# Altium schematic sheet COM-Isolators.SchDoc: CDH-ACS Isolators
size B; Organization: Colorado Space Grant; DocumentNumber: 12; SheetNumber: 7; SheetTotal: 7
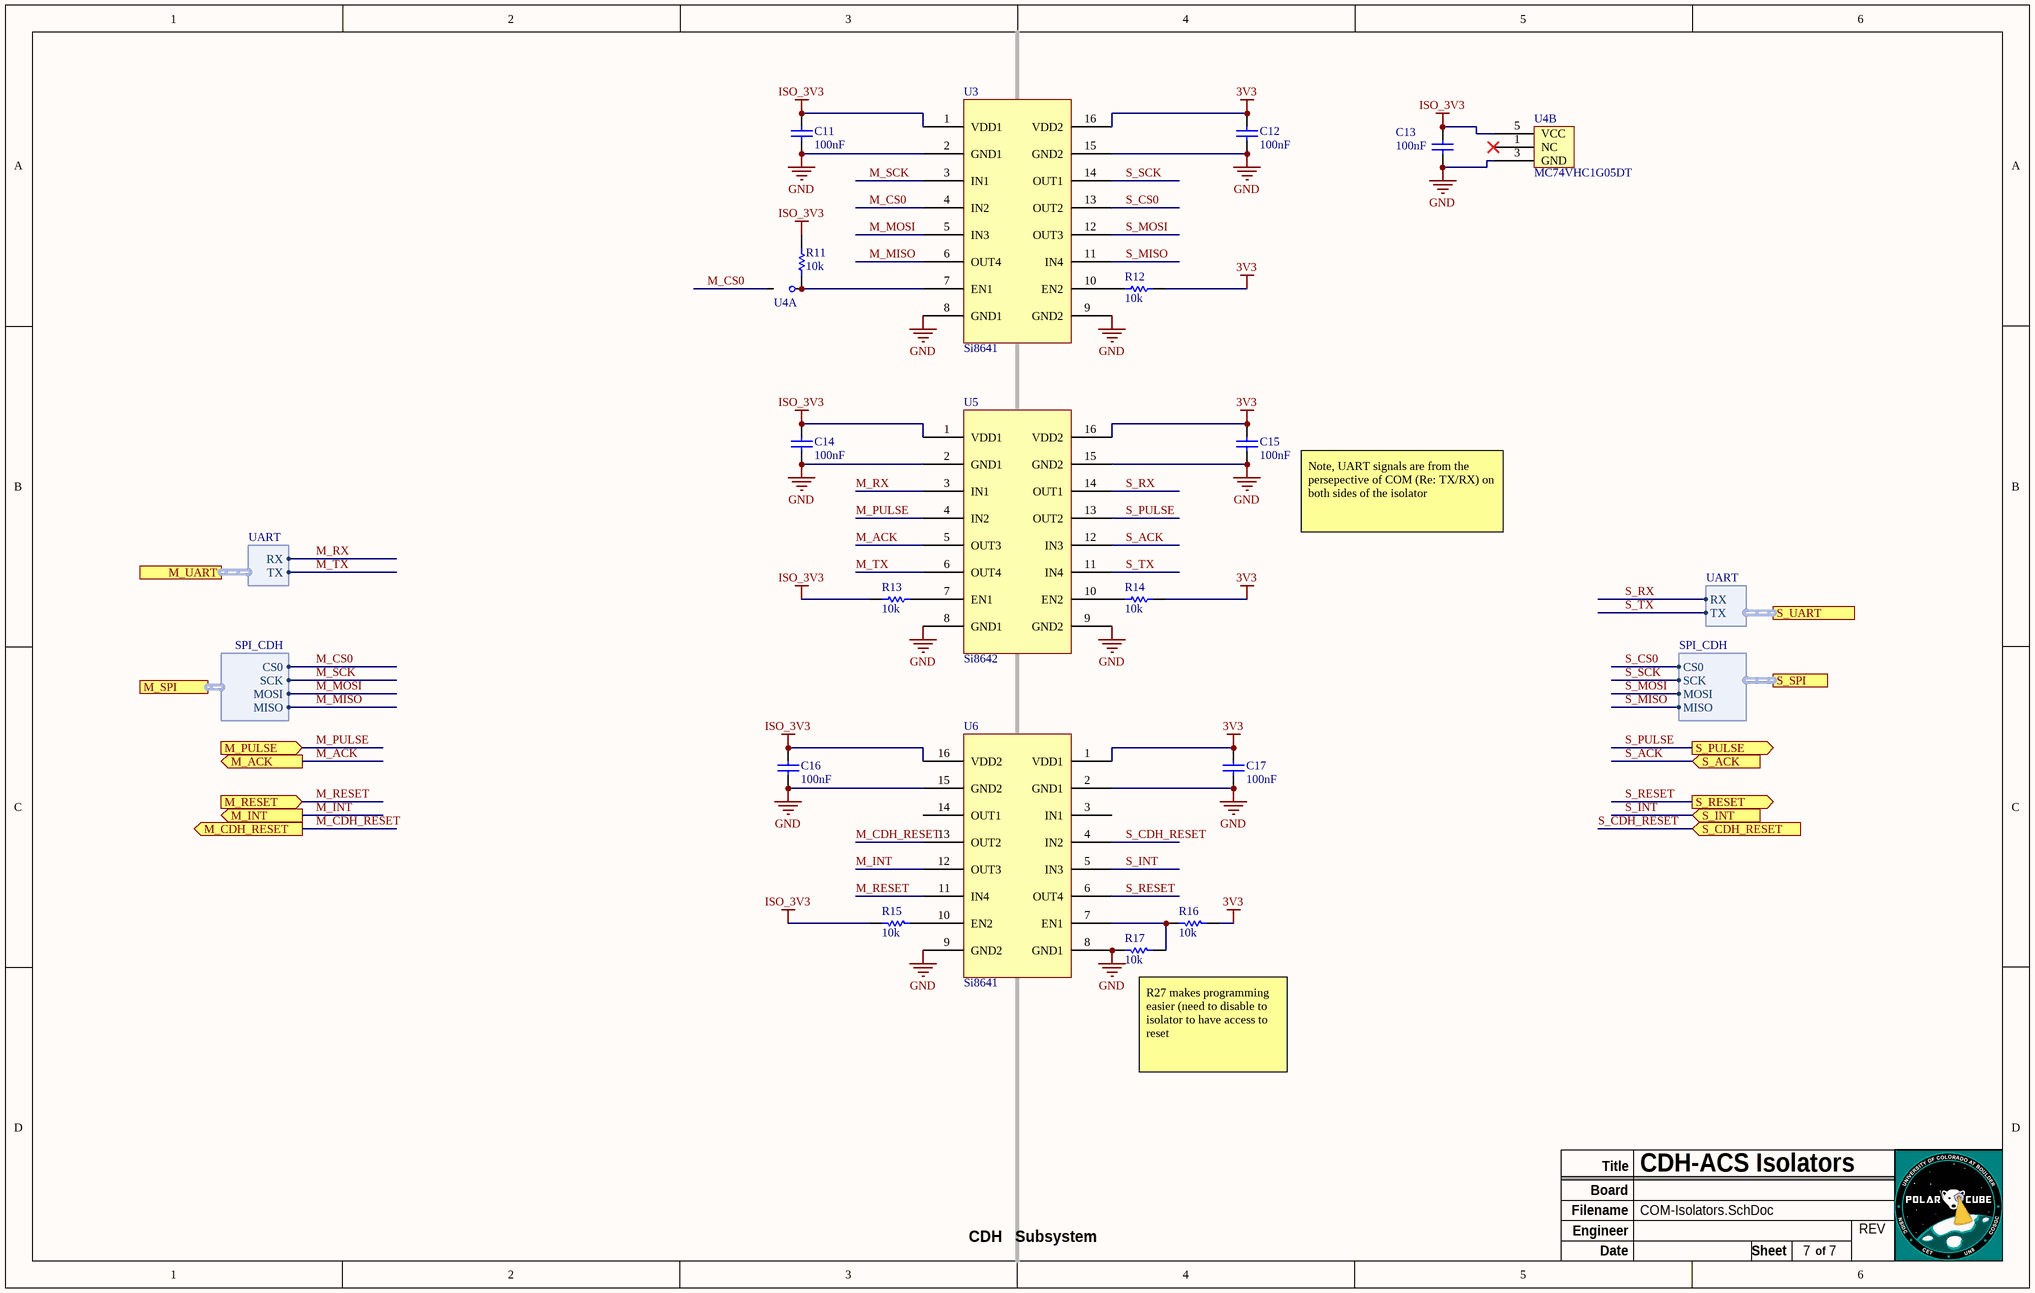
[diagram p0: COM-Isolators.SchDoc]

## Parts
C11  Capacitance: 100nF  [1608[0603]]  (hidden comment: CL10B104KB8ZW6C)
C12  Capacitance: 100nF  [1608[0603]]  (hidden comment: CL10B104KB8ZW6C)
C13  Capacitance: 100nF  [1608[0603]]  (hidden comment: CL10B104KB8ZW6C)
C14  Capacitance: 100nF  [1608[0603]]  (hidden comment: CL10B104KB8ZW6C)
C15  Capacitance: 100nF  [1608[0603]]  (hidden comment: CL10B104KB8ZW6C)
C16  Capacitance: 100nF  [1608[0603]]  (hidden comment: CL10B104KB8ZW6C)
C17  Capacitance: 100nF  [1608[0603]]  (hidden comment: CL10B104KB8ZW6C)
R11  Resistance: 10k  [1608[0603]]  (hidden comment: RMCF0603JG10K0)
R12  Resistance: 10k  [1608[0603]]  (hidden comment: RMCF0603JG10K0)
R13  Resistance: 10k  [1608[0603]]  (hidden comment: RMCF0603JG10K0)
R14  Resistance: 10k  [1608[0603]]  (hidden comment: RMCF0603JG10K0)
R15  Resistance: 10k  [1608[0603]]  (hidden comment: RMCF0603JG10K0)
R16  Resistance: 10k  [1608[0603]]  (hidden comment: RMCF0603JG10K0)  (no BOM)
R17  Resistance: 10k  [1608[0603]]  (hidden comment: RMCF0603JG10K0)
U3  Si8641  [SOP64P600X175-16N]
U4  MC74VHC1G05DT  [TSOP5]  (value not drawn)  (parts A,B of 2)
U5  Si8642  [SOP64P600X175-16N]
U6  Si8641  [SOP64P600X175-16N]

## Ports
M_ACK (out), M_CDH_RESET (out), M_INT (out), M_PULSE (in), M_RESET (in), M_SPI (harness SPI_CDH), M_UART (harness UART), S_ACK (in), S_CDH_RESET (in), S_INT (in), S_PULSE (out), S_RESET (out), S_SPI (harness SPI_CDH), S_UART (harness UART)

## Harnesses
SPI_CDH: CS0, MISO, MOSI, SCK
UART: RX, TX

## Nets
3V3: C12.1 C15.1 C17.1 R12.1 R14.1 R16.2 U3.16(VDD2) U5.16(VDD2) U6.1(VDD1)
GND: C11.2 C12.2 C13.2 C14.2 C15.2 C16.2 C17.2 R17.1 U3.2(GND1) U3.8(GND1) U3.9(GND2) U3.15(GND2) U4.3(GND) U5.2(GND1) U5.8(GND1) U5.9(GND2) U5.15(GND2) U6.2(GND1) U6.8(GND1) U6.9(GND2) U6.15(GND2)
ISO_3V3: C11.1 C13.1 C14.1 C16.1 R11.2 R13.2 R15.2 U3.1(VDD1) U4.5(VCC) U5.1(VDD1) U6.16(VDD2)
M_ACK: U5.5(OUT3) ; port M_ACK
M_CDH_RESET: U6.13(OUT2) ; port M_CDH_RESET
M_CS0: U3.4(IN2) U4.2 ; port M_SPI.CS0
M_INT: U6.12(OUT3) ; port M_INT
M_MISO: U3.6(OUT4) ; port M_SPI.MISO
M_MOSI: U3.5(IN3) ; port M_SPI.MOSI
M_PULSE: U5.4(IN2) ; port M_PULSE
M_RESET: U6.11(IN4) ; port M_RESET
M_RX: U5.3(IN1) ; port M_UART.RX
M_SCK: U3.3(IN1) ; port M_SPI.SCK
M_TX: U5.6(OUT4) ; port M_UART.TX
S_ACK: U5.12(IN3) ; port S_ACK
S_CDH_RESET: U6.4(IN2) ; port S_CDH_RESET
S_CS0: U3.13(OUT2) ; port S_SPI.CS0
S_INT: U6.5(IN3) ; port S_INT
S_MISO: U3.11(IN4) ; port S_SPI.MISO
S_MOSI: U3.12(OUT3) ; port S_SPI.MOSI
S_PULSE: U5.13(OUT2) ; port S_PULSE
S_RESET: U6.6(OUT4) ; port S_RESET
S_RX: U5.14(OUT1) ; port S_UART.RX
S_SCK: U3.14(OUT1) ; port S_SPI.SCK
S_TX: U5.11(IN4) ; port S_UART.TX
NetR11_1: R11.1 U3.7(EN1) U4.4
NetR12_2: R12.2 U3.10(EN2)
NetR13_1: R13.1 U5.7(EN1)
NetR14_2: R14.2 U5.10(EN2)
NetR15_1: R15.1 U6.10(EN2)
NetR16_1: R16.1 R17.2 U6.7(EN1)

Not connected (* = marked no-connect by the designer): U4 1(NC)*; U6 3(IN1) 14(OUT1)

## Notes on the sheet
- Note, UART signals are from the persepective of COM (Re: TX/RX) on both sides of the isolator
- (near R17) R27 makes programming easier (need to disable to isolator to have access to reset
- CDH
- Subsystem
- Title
- Board
- Date
- Engineer
- Filename
- Sheet
- of
- REV

## Library data of the parts
C11-C17 = 5089: MLCC 1608(0603) X7R 100NF 10% 50; PartNumber: CGA3E2X7R1H104K080AE; Manufacturer: TDK; ID: 5089; Category: Ceramic; Status: Unchecked; Tolerance: ±10%; Package: 0603 (1608 Metric); ComponentLink1Description: Datasheet; ComponentLink1URL: http://product.tdk.com/capacitor/mlcc/en/documents/mlcc_automotive_soft_en.pdf
R11-R17 = 20997: 10 kOhms ±5% 0.1W, 1/10W Chip Resistor 0603 (1608 Metric) Automotive AEC-Q200 Thick Film; PartNumber: CRCW060310K0FKEA; Manufacturer: Vishay; ID: 20997; Tolerance: 1%; Category: General Purpose; Status: Unchecked; Power: 0.1W, 1/10W; Package: 0603 (1608 Metric); ComponentLink1Description: Datasheet; ComponentLink1URL: http://www.vishay.com/doc?20035
U3 U6 = Si8641: Low-Power Quad-Channel Digital Isolators; PartNumber: SI8641BA-B-IU; ComponentLink1URL: https://www.silabs.com/Support%20Documents/TechnicalDocs/si864x-datasheet.pdf; ComponentLink1Description: Datasheet
U4 = MC74VHC1G05DT: Manufacturer: ON Semi; ComponentLink1Description: Datasheet; ComponetLink1URL: http://www.onsemi.com/pub_link/Collateral/MC74VHC1G05-D.PDF; PartNumber: MC74VHC1G05DT
U5 = Si8642: Low-Power Quad-Channel Digital Isolators; PartNumber: SI8642BA-B-IU; ComponentLink1URL: https://www.silabs.com/Support%20Documents/TechnicalDocs/si864x-datasheet.pdf; ComponentLink1Description: Datasheet